# Altium project SPNEX_Payload.PrjPcb (part 2 of 3)

## Sheet LM_And_Busler_CAM.SchDoc
size A; SheetNumber: 5; SheetTotal: 6
Used 2 times, as channels LM Probe, High Resolution Camera. Parts and nets are listed once, with the designators drawn on the sheet.
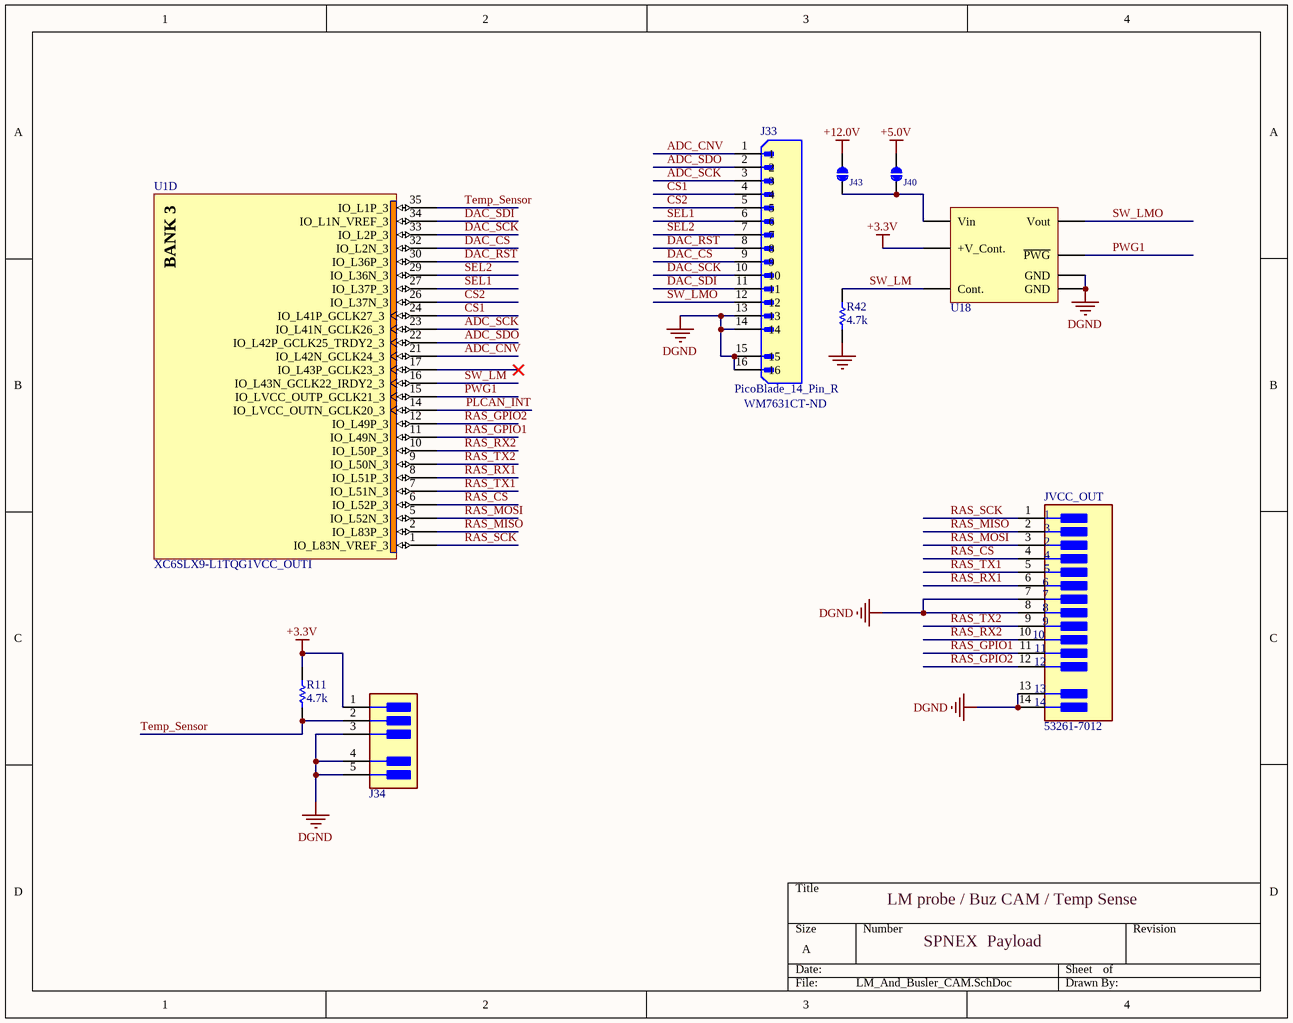
[diagram p3: LM_And_Busler_CAM.SchDoc]

### Parts
J33  PicoBlade_14_Pin_R  Supplier Part Number 1: WM7631CT-ND  [PicoBlade_14_pin_R]
J34  53261-0371  [FP-53261-0371-MFG]  (value not drawn)
J40  JUMPER  [SJMP]  (value not drawn)
J43  JUMPER  [SJMP]  (value not drawn)
JVCC_OUT  53261-7012  [MOLEX_12RA]
R11  Resistance (Ohms): 4.7k  [0603RES]  (hidden comment: RES_4.7K_0.1W_0603)
R42  Resistance (Ohms): 4.7k  [0603RES]  (hidden comment: RES_4.7K_0.1W_0603)
U1  XC6SLX9-L1TQG1VCC_OUTI  [TQG144_M]  (part D of 7)
U18  LTC3461 module  [OCPfootprint]  (value not drawn)

### Nets
+3.3V: J34.1 R11.2 U18.5(+V_Cont.)
+5.0V: J40.2
+12.0V: J43.2
DGND: J33.13 J33.14 J33.15 J33.16 J34.3 J34.4 J34.5 JVCC_OUT.7 JVCC_OUT.8 JVCC_OUT.13(MNT_1) JVCC_OUT.14(MNT_2) R42.2 U18.2(GND) U18.4(GND)
ADC_CNV: J33.1 U1.21(IO_L42N_GCLK24_3)
ADC_SCK: J33.3 U1.23(IO_L41N_GCLK26_3)
ADC_SDO: J33.2 U1.22(IO_L42P_GCLK25_TRDY2_3)
CS1: J33.4 U1.24(IO_L41P_GCLK27_3)
CS2: J33.5 U1.26(IO_L37N_3)
DAC_CS: J33.9 U1.32(IO_L2N_3)
DAC_RST: J33.8 U1.30(IO_L36P_3)
DAC_SCK: J33.10 U1.33(IO_L2P_3)
DAC_SDI: J33.11 U1.34(IO_L1N_VREF_3)
PLCAN_INT: U1.14(IO_LVCC_OUTN_GCLK20_3)
PWG1: U1.15(IO_LVCC_OUTP_GCLK21_3) U18.7(~{PWG})
RAS_CS: JVCC_OUT.4 U1.6(IO_L52P_3)
RAS_GPIO1: JVCC_OUT.11 U1.11(IO_L49N_3)
RAS_GPIO2: JVCC_OUT.12 U1.12(IO_L49P_3)
RAS_MISO: JVCC_OUT.2 U1.2(IO_L83P_3)
RAS_MOSI: JVCC_OUT.3 U1.5(IO_L52N_3)
RAS_RX1: JVCC_OUT.6 U1.8(IO_L51P_3)
RAS_RX2: JVCC_OUT.10 U1.10(IO_L50P_3)
RAS_SCK: JVCC_OUT.1 U1.1(IO_L83N_VREF_3)
RAS_TX1: JVCC_OUT.5 U1.7(IO_L51N_3)
RAS_TX2: JVCC_OUT.9 U1.9(IO_L50N_3)
SEL1: J33.6 U1.27(IO_L37P_3)
SEL2: J33.7 U1.29(IO_L36N_3)
SW_LM: R42.1 U1.16(IO_L43N_GCLK22_IRDY2_3) U18.6(Cont.)
SW_LMO: J33.12 U18.3(Vout)
Temp_Sensor: J34.2 R11.1 U1.35(IO_L1P_3)
NetJ40_1: J40.1 J43.1 U18.1(Vin)

Not connected (* = marked no-connect by the designer): U1 17(IO_L43P_GCLK23_3)*

### Channels
LM Probe: designators end in _LM_Probe
High Resolution Camera: designators end in _High_Resolution_Camera

### Notes on the sheet
- LM probe / Buz CAM / Temp Sense
- (in symbol XC6SLX9-L1TQG144I, part D) BANK 3

### Library data of the parts
J33 = PicoBlade_14_Pin_R: 1.25mm Pitch PicoBlade Header, Surface Mount, Right Angle, Lead-Free, 14 Circuits; Manufacturer: Molex; Manufacturer Part Number: 53261-1471; Supplier 1: Digi-Key; RoHS: Yes; Category: Headers and Wire Housings; ComponentLink1URL: https://datasheet.ciiva.com/5155/0532611471-pcb-headers-256969-5155455.pdf?src-supplier=Mouser; ComponentLink1Description: https://datasheet.ciiva.com/5155/0532611471-pcb-headers-256969-5155455.pdf?src-supplier=Mouser; ComponentLink2URL: https://datasheet.ciiva.com/30130/318250532611471-pcb-headers-30130464.pdf?src-supplier=Onlinecomponents.com; ComponentLink2Description: https://datasheet.ciiva.com/30130/318250532611471-pcb-headers-30130464.pdf?src-supplier=Onlinecomponents.com; ComponentLink3URL: https://datasheet.ciiva.com/11747/0900766b80d6dd0d-11747778.pdf?src-supplier=RSComponents; ComponentLink3Description: https://datasheet.ciiva.com/11747/0900766b80d6dd0d-11747778.pdf?src-supplier=RSComponents; ComponentLink4URL: https://datasheet.ciiva.com/7167/1626126-7167505.pdf?src-supplier=Newark; ComponentLink4Description: https://datasheet.ciiva.com/7167/1626126-7167505.pdf?src-supplier=Newark; ComponentLink5URL: https://datasheet.ciiva.com/14156/gh116861-116874-e-14156197.pdf?src-supplier=Distrelec; ComponentLink5Description: https://datasheet.ciiva.com/14156/gh116861-116874-e-14156197.pdf?src-supplier=Distrelec; ComponentLink6URL: https://datasheet.ciiva.com/7814/1767586-7814875.pdf?src-supplier=Element14; ComponentLink6Description: https://datasheet.ciiva.com/7814/1767586-7814875.pdf?src-supplier=Element14
J34 = 0532610371: Conn Shrouded Header HDR 3 POS 1.25mm Solder RA SMD PicoBlade™ Embossed T/R; Manufacturer: Molex; ComponentLink2Description: Datasheet; ComponentLink2URL: https://www.molex.com/webdocs/datasheets/pdf/en-us/0532610371_PCB_HEADERS.pdf; Supplier 1: Digi-Key; Manufacturer Part Number: 53261-0371; RoHS: Yes; Category: Headers and Wire Housings; Stock 1: 30734; Pricing 1: 1=0.72000, 10=0.61000, 100=0.47430 (USD); Supplier Part Number 1: WM7621CT-ND
J40 J43 = JUMPER: OPTION SELECTION PAD; Supplier 1: Digi-Key
JVCC_OUT = 53261-7012: 1.25mm Pitch, PicoBlade PCB Header, Single Row, Right-Angle, Surface Mount, Gold (Au) Plating, Friction Lock, 12...; Manufacturer: Molex; Supplier 1: Digi-Key; Manufacturer Part Number: 53261-7012; RoHS: No; Category: Headers and Wire Housings; Stock 1: 1355; Pricing 1: 1=2.68000, 10=2.28100, 100=1.88470 (USD); Supplier Part Number 1: 900-0532617012CT-ND
R11 R42 = RES_4.7K_0.1W_0603: Resistor; Manufacturer: Stackpole Electronics Inc.; Manufacturer Part Number: RMCF0603JT4K70; Tolerance: ±5%; Power (Watts): 0.1W, 1/10W; Temperature Coefficient: ±200ppm/°C; Supplier 1: Digi-Key; RoHS: RoHS Compliant; Category: Resistors; Stock 1: 86000; Pricing 1: 1=0.1, 10=0.012, 25=0.0088, 50=0.0066, 100=0.0049, 250=0.00372, 500=0.00298, 1000=0.0022 (USD); Packaging: Cut Tape (CT); Part Status: Active; Composition: Thick Film; Features: Automotive AEC-Q200; Operating Temperature: -55°C ~ 155°C; Package / Case: 0603 (1608 Metric); Supplier Device Package: 0603; Size / Dimension: 0.061" L x 0.031" W (1.55mm x 0.80mm); Height - Seated (Max): 0.022" (0.55mm); Number of Terminations: 2; Failure Rate: -; ComponentLink1URL: https://www.seielect.com/Catalog/SEI-RMCF_RMCP.pdf; ComponentLink1Description: https://www.seielect.com/Catalog/SEI-RMCF_RMCP.pdf; Supplier Part Number 1: RMCF0603JT4K70CT-ND
U1 = XC6SLX9-L1TQG144I: Spartan-6 LX 1.0V FPGA, 102 User I/Os, 144-Pin TQFP (0.5mm Pitch), Low Power Version, Industrial Grade, Pb-Free; Published: 17-Nov-2009; DatasheetVersion: ver1.6, Nov-2010; PackageVersion: ver1.2, Jun-2004; PackageReference: TQG144; Publisher: Altium Limited; PackageDescription: 144-Pin Thin Quad Flat Pack (TQG144) - Pb-Free; Code_JEDEC: MS-026-BFB; ComponentLink1Description: Manufacturer Link; ComponentLink1URL: http://www.xilinx.com; ComponentLink2Description: Spartan-6 Datasheet; ComponentLink2URL: http://www.xilinx.com/support/documentation/data_sheets/ds160.pdf; ComponentLink3Description: Spartan-6 Documents; ComponentLink3URL: http://www.xilinx.com/support/documentation/spartan-6.htm; ComponentLink4Description: Xilinx.com Home; ComponentLink4URL: http://www.xilinx.com; Supplier 1: Digi-Key; Supplier Part Number 1: 122-1779-ND
U18 = OCP_Module

## Sheet Storage Memory.SchDoc
size A; SheetNumber: 6; SheetTotal: 6
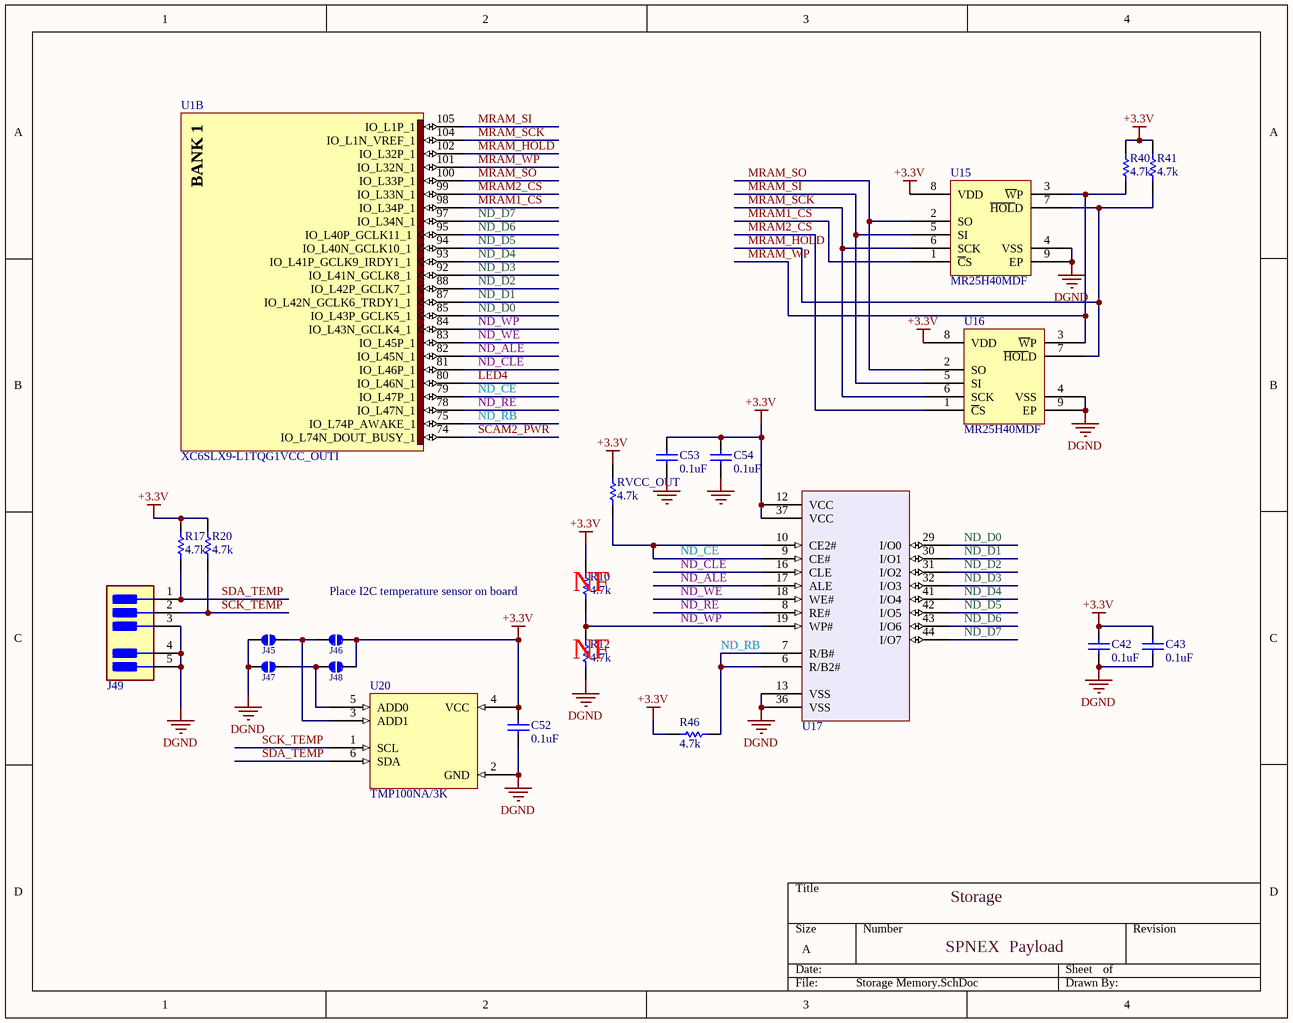
[diagram p4: Storage Memory.SchDoc]

### Parts
C42  0.1uF  [0805CAP]
C43  0.1uF  [0805CAP]
C52  0.1uF  [0805CAP]
C53  value 0.1uF  [0805 - CAP]  (hidden comment: Cap_CER_0.1U_16V_0805)
C54  value 0.1uF  [0805 - CAP]  (hidden comment: Cap_CER_0.1U_16V_0805)
J45  JUMPER  [SJMP]  (value not drawn)
J46  JUMPER  [SJMP]  (value not drawn)
J47  JUMPER  [SJMP]  (value not drawn)
J48  JUMPER  [SJMP]  (value not drawn)
J49  53261-0371  [FP-53261-0371-MFG]  (value not drawn)
R10  Resistance (Ohms): 4.7k  [0603RES]  (hidden comment: RES_4.7K_0.1W_0603)
R12  Resistance (Ohms): 4.7k  [0603RES]  (hidden comment: RES_4.7K_0.1W_0603)
R17  Resistance (Ohms): 4.7k  [0603RES]  (hidden comment: RES_4.7K_0.1W_0603)
R20  Resistance (Ohms): 4.7k  [0603RES]  (hidden comment: RES_4.7K_0.1W_0603)
R40  Resistance (Ohms): 4.7k  [0603RES]  (hidden comment: RES_4.7K_0.1W_0603)
R41  Resistance (Ohms): 4.7k  [0603RES]  (hidden comment: RES_4.7K_0.1W_0603)
R46  Resistance (Ohms): 4.7k  [0603RES]  (hidden comment: RES_4.7K_0.1W_0603)
RVCC_OUT  Resistance (Ohms): 4.7k  [0603RES]  (hidden comment: RES_4.7K_0.1W_0603)
U1  XC6SLX9-L1TQG1VCC_OUTI  [TQG144_M]  (part B of 7)
U15  MR25H40MDF  [DFN8]
U16  MR25H40MDF  [DFN8]
U17  MT29F8G08AB  [VOG48]  (value not drawn)
U20  TMP100NA/3K  [SOT-23-6]

### Nets
+3.3V: C42.2 C43.2 C52.2 C53.2 C54.2 J46.1 J48.1 R10.2 R17.2 R20.2 R40.1 R41.1 R46.1 RVCC_OUT.2 U15.8(VDD) U16.8(VDD) U17.12(VCC) U17.37(VCC) U20.4(VCC)
DGND: C42.1 C43.1 C52.1 C53.1 C54.1 J45.2 J47.2 J49.3 J49.4 J49.5 R12.1 U15.4(VSS) U15.9(EP) U16.4(VSS) U16.9(EP) U17.13(VSS) U17.36(VSS) U20.2(GND)
LED4: U1.80(IO_L46N_1)
MRAM1_CS: U1.98(IO_L34P_1) U15.1(~{C}S)
MRAM2_CS: U1.99(IO_L33N_1) U16.1(~{C}S)
MRAM_HOLD: R41.2 U1.102(IO_L32P_1) U15.7(~{HOL}D) U16.7(~{HOL}D)
MRAM_SCK: U1.104(IO_L1N_VREF_1) U15.6(SCK) U16.6(SCK)
MRAM_SI: U1.105(IO_L1P_1) U15.5(SI) U16.5(SI)
MRAM_SO: U1.100(IO_L33P_1) U15.2(SO) U16.2(SO)
MRAM_WP: R40.2 U1.101(IO_L32N_1) U15.3(~{W}P) U16.3(~{W}P)
ND_ALE: U1.82(IO_L45N_1) U17.17(ALE)
ND_CE: RVCC_OUT.1 U1.79(IO_L47P_1) U17.9(CE#) U17.10(CE2#)
ND_CLE: U1.81(IO_L46P_1) U17.16(CLE)
ND_D0: U1.85(IO_L43P_GCLK5_1) U17.29(I/O0)
ND_D1: U1.87(IO_L42N_GCLK6_TRDY1_1) U17.30(I/O1)
ND_D2: U1.88(IO_L42P_GCLK7_1) U17.31(I/O2)
ND_D3: U1.92(IO_L41N_GCLK8_1) U17.32(I/O3)
ND_D4: U1.93(IO_L41P_GCLK9_IRDY1_1) U17.41(I/O4)
ND_D5: U1.94(IO_L40N_GCLK10_1) U17.42(I/O5)
ND_D6: U1.95(IO_L40P_GCLK11_1) U17.43(I/O6)
ND_D7: U1.97(IO_L34N_1) U17.44(I/O7)
ND_RB: R46.2 U1.75(IO_L74P_AWAKE_1) U17.6(R/B2#) U17.7(R/B#)
ND_RE: U1.78(IO_L47N_1) U17.8(RE#)
ND_WE: U1.83(IO_L45P_1) U17.18(WE#)
ND_WP: R10.1 R12.2 U1.84(IO_L43N_GCLK4_1) U17.19(WP#)
SCAM2_PWR: U1.74(IO_L74N_DOUT_BUSY_1)
SCK_TEMP: J49.2 R20.1 U20.1(SCL)
SDA_TEMP: J49.1 R17.1 U20.6(SDA)
NetJ45_1: J45.1 J46.2 U20.3(ADD1)
NetJ47_1: J47.1 J48.2 U20.5(ADD0)

### Notes on the sheet
- Place I2C temperature sensor on board
- (near R10) NF
- (near R12) NF
- Storage
- (in symbol XC6SLX9-L1TQG144I, part B) BANK 1

### Library data of the parts
C42 C43 C52 = CAP_CER_0.1uf_10V_0805: Surface Mount Ceramic Multilayer Capacitor 0.1uF 10% X7R 16V 0805 Paper T/R; Manufacturer: Yageo; Manufacturer Part Number: CC0805KRX7R7BB104; Capacitance: 100nF; Insulation Resistance: 100GR; Supplier 1: Digi-Key; RoHS: Yes; Category: Ceramic Capacitors; Pricing 1: 1=0.12000, 10=0.08400, 50=0.04760, 100=0.03950, 500=0.02768, 1000=0.02291 (USD); Mount: Surface Mount; Case/Package: 0805; Number of Pins: 2; Case Code (Metric): 2012; Case Code (Imperial): 0805; Min Operating Temperature: -55°C; Max Operating Temperature: 125°C; Tolerance: 10%; Voltage Rating: 16V; Voltage Rating (DC): 16V; Packaging: Tape and Reel; Package Quantity: 1; Dielectric: X7R; Termination: SMD/SMT; Resistor Type: Ceramic; Voltage: 16V; Series: CC; Length: 2mm; Width: 0.049inch; Height: 0.85mm; Thickness: 0.033inch; Depth: 1.25mm; Radiation Hardening: No; REACH SVHC: No SVHC; Lead Free: Lead Free; Halogen Free: Halogen Free; RoHS Compliant: Yes; ComponentLink1URL: https://datasheet.ciiva.com/8034/1784427-8034017.pdf?src-supplier=Element14; ComponentLink1Description: https://datasheet.ciiva.com/8034/1784427-8034017.pdf?src-supplier=Element14; ComponentLink2URL: https://datasheet.ciiva.com/11786/0900766b80d84f1d-11786102.pdf?src-supplier=RSComponents; ComponentLink2Description: https://datasheet.ciiva.com/11786/0900766b80d84f1d-11786102.pdf?src-supplier=RSComponents; ComponentLink3URL: https://datasheet.ciiva.com/7978/1489800-7978204.pdf?src-supplier=Element14; ComponentLink3Description: https://datasheet.ciiva.com/7978/1489800-7978204.pdf?src-supplier=Element14; ComponentLink4URL: https://datasheet.ciiva.com/144/mlccorderingcode-144999.pdf?src-supplier=Digi-Key; ComponentLink4Description: https://datasheet.ciiva.com/144/mlccorderingcode-144999.pdf?src-supplier=Digi-Key; ComponentLink5URL: https://datasheet.ciiva.com/144/mlccorderingcode-144998.pdf?src-supplier=Digi-Key; ComponentLink5Description: https://datasheet.ciiva.com/144/mlccorderingcode-144998.pdf?src-supplier=Digi-Key; ComponentLink6URL: https://datasheet.ciiva.com/145/mlccorderingcode-145000.pdf?src-supplier=Digi-Key; ComponentLink6Description: https://datasheet.ciiva.com/145/mlccorderingcode-145000.pdf?src-supplier=Digi-Key; ComponentLink7URL: https://datasheet.ciiva.com/8034/1784427-8034015.pdf?src-supplier=Element14; ComponentLink7Description: https://datasheet.ciiva.com/8034/1784427-8034015.pdf?src-supplier=Element14; ComponentLink8URL: https://datasheet.ciiva.com/11465/upy-gphc-x7r-6-3v-to-50v-8-11465289.pdf?src-supplier=Avnet; ComponentLink8Description: https://datasheet.ciiva.com/11465/upy-gphc-x7r-6-3v-to-50v-8-11465289.pdf?src-supplier=Avnet; ComponentLink9URL: https://datasheet.ciiva.com/15189/getdatasheetpartid-314877-15189221.pdf?src-supplier=Verical; ComponentLink9Description: https://datasheet.ciiva.com/15189/getdatasheetpartid-314877-15189221.pdf?src-supplier=Verical; Supplier Part Number 1: 311-1142-1-ND
C53 C54 = Cap_CER_0.1U_16V_0805: CAP CER 0.1UF 16V X7R 0805; Manufacturer: Samsung Electro-Mechanics America, Inc.; Manufacturer Part Number: CL21B104KOANNNC; Tolerance: ±10%; Capacitance: 0.10µF; Supplier 1: Digi-Key; RoHS: RoHS Compliant; Category: Capacitors; Stock 1: 126841; Pricing 1: 1=0.1, 10=0.033, 25=0.024, 50=0.018, 100=0.0147, 250=0.01232, 500=0.0105, 1000=0.00825 (USD); Packaging: Digi-Reel®; Part Status: Active; Voltage - Rated: 16V; Temperature Coefficient: X7R; Operating Temperature: -55°C ~ 125°C; Features: -; Ratings: -; Applications: General Purpose; Mounting Type: Surface Mount, MLCC; Package / Case: 0805 (2012 Metric); Size / Dimension: 0.079" L x 0.049" W (2.00mm x 1.25mm); Height - Seated (Max): -; Thickness (Max): 0.030" (0.75mm); Lead Spacing: -; Lead Style: -; ComponentLink1URL: http://www.samsungsem.com/kr/support/product-search/mlcc/__icsFiles/afieldfile/2016/08/18/S_CL21B104KOANNNC.pdf; ComponentLink1Description: http://www.samsungsem.com/kr/support/product-search/mlcc/__icsFiles/afieldfile/2016/08/18/S_CL21B104KOANNNC.pdf; Supplier Part Number 1: 1276-2448-6-ND
J45-J48 = JUMPER: OPTION SELECTION PAD; Supplier 1: Digi-Key
J49 = 0532610371: as J34 on sheet LM_And_Busler_CAM; ComponentLink2Description: Datasheet; ComponentLink2URL: https://www.molex.com/webdocs/datasheets/pdf/en-us/0532610371_PCB_HEADERS.pdf; Supplier 1: Digi-Key; Manufacturer Part Number: 53261-0371; RoHS: Yes; Category: Headers and Wire Housings; Stock 1: 30734; Pricing 1: 1=0.72000, 10=0.61000, 100=0.47430 (USD); Supplier Part Number 1: WM7621CT-ND
R10 R12 R17 R20 R40 R41 R46 RVCC_OUT = RES_4.7K_0.1W_0603: as R11 on sheet LM_And_Busler_CAM; Supplier 1: Digi-Key; RoHS: RoHS Compliant; Category: Resistors; Stock 1: 86000; Pricing 1: 1=0.1, 10=0.012, 25=0.0088, 50=0.0066, 100=0.0049, 250=0.00372, 500=0.00298, 1000=0.0022 (USD); Packaging: Cut Tape (CT); Part Status: Active; Composition: Thick Film; Features: Automotive AEC-Q200; Operating Temperature: -55°C ~ 155°C; Package / Case: 0603 (1608 Metric); Supplier Device Package: 0603; Size / Dimension: 0.061" L x 0.031" W (1.55mm x 0.80mm); Height - Seated (Max): 0.022" (0.55mm); Number of Terminations: 2; Failure Rate: -; ComponentLink1URL: https://www.seielect.com/Catalog/SEI-RMCF_RMCP.pdf; ComponentLink1Description: https://www.seielect.com/Catalog/SEI-RMCF_RMCP.pdf; Supplier Part Number 1: RMCF0603JT4K70CT-ND
U1 = XC6SLX9-L1TQG144I: as U1 on sheet LM_And_Busler_CAM; Published: 17-Nov-2009; DatasheetVersion: ver1.6, Nov-2010; PackageVersion: ver1.2, Jun-2004; PackageReference: TQG144; Publisher: Altium Limited; PackageDescription: 144-Pin Thin Quad Flat Pack (TQG144) - Pb-Free; Code_JEDEC: MS-026-BFB; ComponentLink1Description: Manufacturer Link; ComponentLink1URL: http://www.xilinx.com; ComponentLink2Description: Spartan-6 Datasheet; ComponentLink2URL: http://www.xilinx.com/support/documentation/data_sheets/ds160.pdf; ComponentLink3Description: Spartan-6 Documents; ComponentLink3URL: http://www.xilinx.com/support/documentation/spartan-6.htm; ComponentLink4Description: Xilinx.com Home; ComponentLink4URL: http://www.xilinx.com; Supplier 1: Digi-Key; Supplier Part Number 1: 122-1779-ND
U15 U16 = MR25H40MDF: IC MRAM 4MBIT 40MHZ 8DFN; Manufacturer: Everspin Technologies Inc.; Memory Type: Non-Volatile; Memory Format: RAM; Memory Size: 4Mb (512K x 8); Memory Interface: SPI; Voltage - Supply: 3 V ~ 3.6 V; Supplier 1: Digi-Key; Manufacturer Part Number: MR25H40MDF; RoHS: RoHS Compliant; Category: Integrated Circuits (ICs); Stock 1: 1016; Pricing 1: 1=17.53, 10=16.232, 25=16.0068, 50=15.8102, 100=13.856, 250=13.257, 500=13.16862 (USD); Packaging: Tray; Part Status: Active; Technology: MRAM (Magnetoresistive RAM); Write Cycle Time - Word, Page: -; Operating Temperature: -40°C ~ 125°C (TA); Mounting Type: Surface Mount; Package / Case: 8-VDFN Exposed Pad; Supplier Device Package: 8-DFN-EP, Small Flag (5x6); ComponentLink1URL: https://www.everspin.com/file/156640/download; ComponentLink1Description: https://www.everspin.com/file/156640/download; Supplier Part Number 1: 819-1055-ND
U17 = MT29F32G08AFABAWP: 8Gb x8 NAND Flash Memory; CircuitryPartsPN: MICRON-MT29F8G08FACWP; ManufacturerPN: MT29F8G08FACWP; Manufacturer: Micron Technology Inc; CategoryI: Integrated Circuits (ICs); SchematicRev: A; DesignedBy: Circuitry Parts; MfgURL: http://www.micron.com/; PackageName: TSOPI48; FootprintName: *; CategoryII: NAND FLASH MEMORY; Value: *; DesignedOn: 7/18/2005 3:01:38 PM
U20 = Temp_Sensor_I2C: SENSOR TEMP I2C/SMBUS SOT23-6; Manufacturer: Texas Instruments; Interface: I2C,SMBus,2-Wire; Max Supply Voltage: 5.5V; Min Supply Voltage: 2.7V; Output Current: 4mA; Nominal Supply Current: 150uA; Resolution: 12b; Operating Supply Current: 75uA; Quiescent Current: 45uA; Number of Bits: 12; Output Type: I2C,Digital; Supplier 1: Digi-Key; RoHS: Yes; Category: Integrated Circuits (ICs); Stock 1: 2604; Pricing 1: 1=2.67000, 5=2.53000, 10=2.16900, 25=1.73520, 50=1.59040, 100=1.44590, 500=1.26516, 1000=1.12057 (USD); Mount: Surface Mount; Case/Package: SOT-23; Number of Pins: 6; Contact Plating: Gold; Min Operating Temperature: -55°C; Max Operating Temperature: 125°C; Package Quantity: 1; Packaging: Tape and Reel; Max Supply Voltage (DC): 5.5V; Min Supply Voltage (DC): 2.7V; Series: -; Supply Current: 150uA; Radiation Hardening: No; Lead Free: Lead Free; Reach SVHC Compliant: Yes; RoHS Compliant: Yes; ComponentLink1URL: https://datasheet.ciiva.com/15098/getdatasheetpartid-300076-15098434.pdf?src-supplier=Verical; ComponentLink1Description: https://datasheet.ciiva.com/15098/getdatasheetpartid-300076-15098434.pdf?src-supplier=Verical; ComponentLink2URL: https://datasheet.ciiva.com/41462/001014642-da-01-en-ic-temp-sensor-di-tmp100na-3k-sot-6-tid-41462493.pdf?src-supplier=Conrad; ComponentLink2Description: https://datasheet.ciiva.com/41462/001014642-da-01-en-ic-temp-sensor-di-tmp100na-3k-sot-6-tid-41462493.pdf?src-supplier=Conrad; ComponentLink3URL: https://datasheet.ciiva.com/5786/87915-5786666.pdf?src-supplier=Farnell; ComponentLink3Description: https://datasheet.ciiva.com/5786/87915-5786666.pdf?src-supplier=Farnell; ComponentLink4URL: https://datasheet.ciiva.com/1514/1772209-1514093.pdf?src-supplier=Element14; ComponentLink4Description: https://datasheet.ciiva.com/1514/1772209-1514093.pdf?src-supplier=Element14; ComponentLink5URL: https://datasheet.ciiva.com/46390/1882709-46390844.pdf?src-supplier=Element14; ComponentLink5Description: https://datasheet.ciiva.com/46390/1882709-46390844.pdf?src-supplier=Element14; ComponentLink6URL: https://datasheet.ciiva.com/2003/tmp100-2003004.pdf?src-supplier=Digi-Key; ComponentLink6Description: https://datasheet.ciiva.com/2003/tmp100-2003004.pdf?src-supplier=Digi-Key; ComponentLink7URL: https://datasheet.ciiva.com/2003/tmp100-2003003.pdf?src-supplier=Digi-Key; ComponentLink7Description: https://datasheet.ciiva.com/2003/tmp100-2003003.pdf?src-supplier=Digi-Key; ComponentLink8URL: https://datasheet.ciiva.com/2003/tmp100-2003005.pdf?src-supplier=Digi-Key; ComponentLink8Description: https://datasheet.ciiva.com/2003/tmp100-2003005.pdf?src-supplier=Digi-Key; ComponentLink9URL: https://datasheet.ciiva.com/3280/tmp101-3280141.pdf?src-supplier=Avnet; ComponentLink9Description: https://datasheet.ciiva.com/3280/tmp101-3280141.pdf?src-supplier=Avnet; Supplier Part Number 1: 296-26833-1-ND; Manufacturer Part Number: TMP100NA/3K

## Sheet BUS.SchDoc
size A4; SheetNumber: 3; SheetTotal: 6
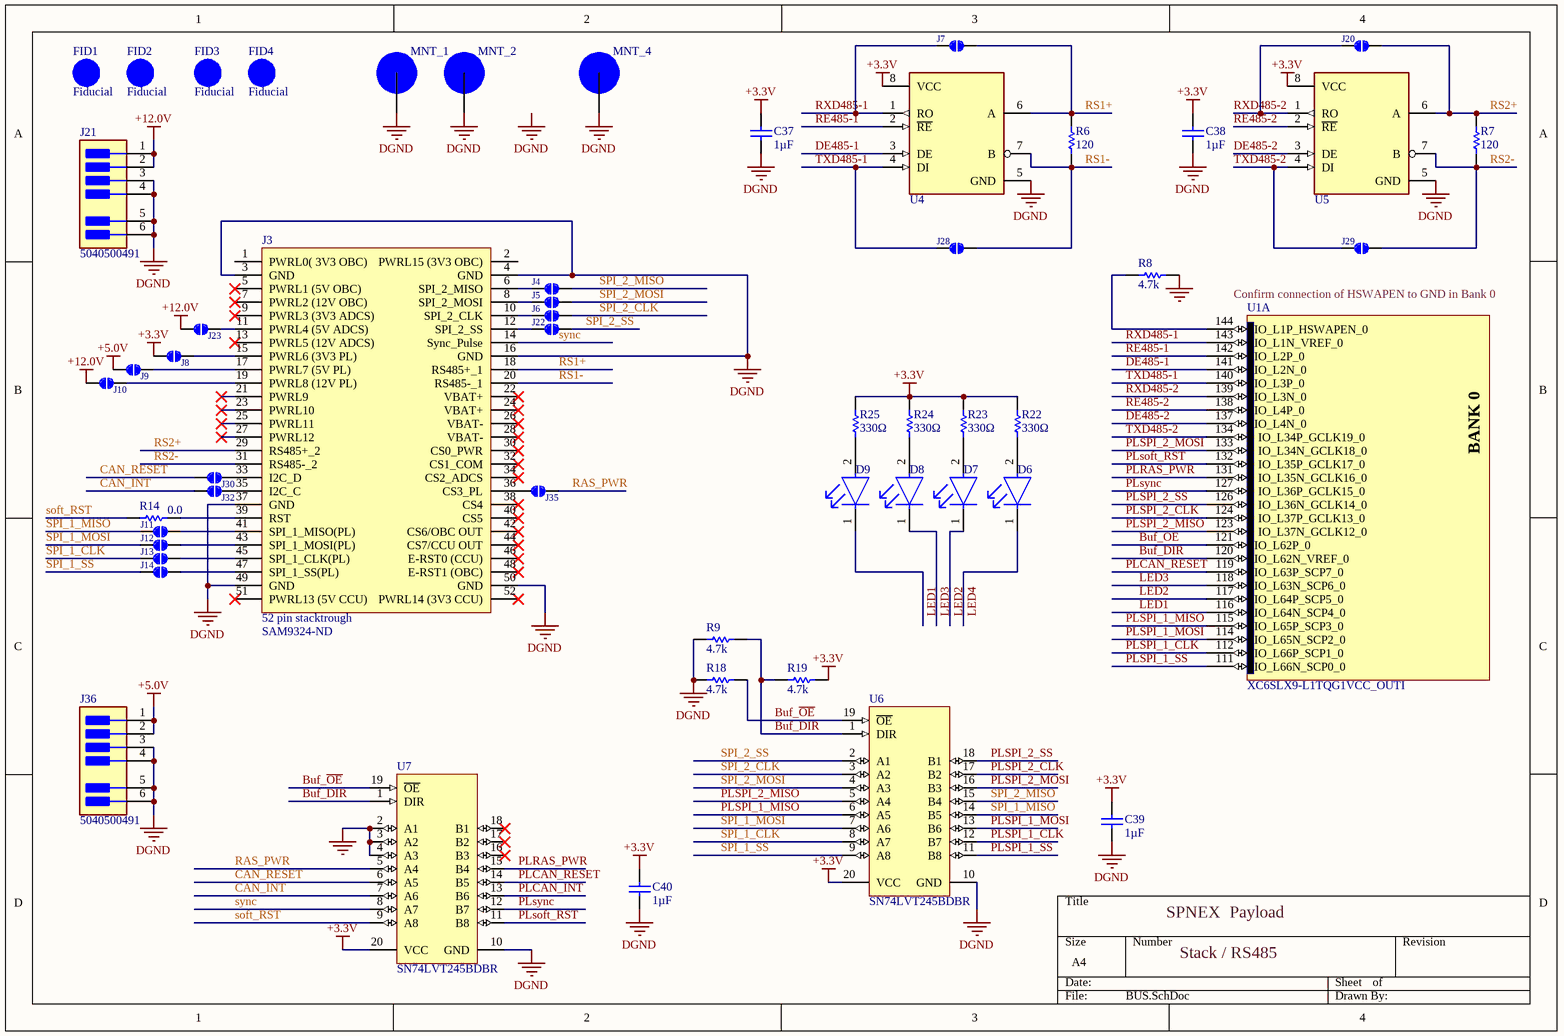
[diagram p5: BUS.SchDoc]

### Parts
C37  Capacitance: 1µF  [0603CAP]  (hidden comment: Cap_CER_1U_10V_0603)
C38  Capacitance: 1µF  [0603CAP]  (hidden comment: Cap_CER_1U_10V_0603)
C39  Capacitance: 1µF  [0603CAP]  (hidden comment: Cap_CER_1U_10V_0603)
C40  Capacitance: 1µF  [0603CAP]  (hidden comment: Cap_CER_1U_10V_0603)
D6  LED RED CLEAR 2SMD  [ROHM_SML-21_MFG]  (value not drawn)
D7  LED RED CLEAR 2SMD  [ROHM_SML-21_MFG]  (value not drawn)
D8  LED RED CLEAR 2SMD  [ROHM_SML-21_MFG]  (value not drawn)
D9  LED RED CLEAR 2SMD  [ROHM_SML-21_MFG]  (value not drawn)
FID1  Fiducial  [FID]  (no BOM)
FID2  Fiducial  [FID]  (no BOM)
FID3  Fiducial  [FID]  (no BOM)
FID4  Fiducial  [FID]  (no BOM)
J3  52 pin stacktrough  Supplier Part Number 1: SAM9324-ND  [StackThrough52]
J4  JUMPER  [SJMP]  (value not drawn)
J5  JUMPER  [SJMP]  (value not drawn)
J6  JUMPER  [SJMP]  (value not drawn)
J7  JUMPER  [SJMP]  (value not drawn)
J8  JUMPER  [SJMP]  (value not drawn)
J9  JUMPER  [SJMP]  (value not drawn)
J10  JUMPER  [SJMP]  (value not drawn)
J11  JUMPER  [SJMP]  (value not drawn)
J12  JUMPER  [SJMP]  (value not drawn)
J13  JUMPER  [SJMP]  (value not drawn)
J14  JUMPER  [SJMP]  (value not drawn)
J20  JUMPER  [SJMP]  (value not drawn)
J21  5040500491  [MOLEX_5040500491]
J22  JUMPER  [SJMP]  (value not drawn)
J23  JUMPER  [SJMP]  (value not drawn)
J28  JUMPER  [SJMP]  (value not drawn)
J29  JUMPER  [SJMP]  (value not drawn)
J30  JUMPER  [SJMP]  (value not drawn)
J32  JUMPER  [SJMP]  (value not drawn)
J35  JUMPER  [SJMP]  (value not drawn)
J36  5040500491  [MOLEX_5040500491]
MNT_1  Mount Hole  [Mount_Hole]  (value not drawn)  (no BOM)
MNT_2  Mount Hole  [Mount_Hole]  (value not drawn)  (no BOM)
MNT_4  Mount Hole  [Mount_Hole]  (value not drawn)  (no BOM)
R6  Resistance (Ohms): 120  [0603RES]  (hidden comment: RES_120_0.25W_0603)
R7  Resistance (Ohms): 120  [0603RES]  (hidden comment: RES_120_0.25W_0603)
R8  Resistance (Ohms): 4.7k  [0603RES]  (hidden comment: RES_4.7K_0.1W_0603)
R9  Resistance (Ohms): 4.7k  [0603RES]  (hidden comment: RES_4.7K_0.1W_0603)
R14  Resistance (Ohms): 0.0  [0603RES]  (hidden comment: RES_0_0.1W_0603)
R18  Resistance (Ohms): 4.7k  [0603RES]  (hidden comment: RES_4.7K_0.1W_0603)
R19  Resistance (Ohms): 4.7k  [0603RES]  (hidden comment: RES_4.7K_0.1W_0603)
R22  Resistance: 330Ω  [0603]  (hidden comment: RES_330 Ohm_0603)
R23  Resistance: 330Ω  [0603]  (hidden comment: RES_330 Ohm_0603)
R24  Resistance: 330Ω  [0603]  (hidden comment: RES_330 Ohm_0603)
R25  Resistance: 330Ω  [0603]  (hidden comment: RES_330 Ohm_0603)
U1  XC6SLX9-L1TQG1VCC_OUTI  [TQG144_M]  (part A of 7)
U4  ADM3493ARZ  [Soic8_IPCA]  (value not drawn)
U5  ADM3493ARZ  [Soic8_IPCA]  (value not drawn)
U6  SN74LVT245BDBR  [DB0020A_M]
U7  SN74LVT245BDBR  [DB0020A_M]

### Nets
+3.3V: C37.2 C38.2 C39.2 C40.2 J8.1 R19.1 R22.2 R23.2 R24.2 R25.2 U4.8(VCC) U5.8(VCC) U6.20(VCC) U7.20(VCC)
+5.0V: J9.1 J36.1 J36.2
+12.0V: J10.1 J21.1 J21.2 J23.1
DGND: C37.1 C38.1 C39.1 C40.1 J3.3(GND) J3.4(GND) J3.16(GND) J3.37(GND) J3.49(GND) J3.50(GND) J21.3 J21.4 J21.5 J21.6 J36.3 J36.4 J36.5 J36.6 MNT_1.1 MNT_2.1 MNT_4.1 R8.2 R9.2 R18.2 U4.5(GND) U5.5(GND) U6.10(GND) U7.2(A1) U7.3(A2) U7.4(A3) U7.10(GND)
Buf_DIR: R9.1 R19.2 U1.120(IO_L62N_VREF_0) U6.1(DIR) U7.1(DIR)
Buf_~{OE}: R18.1 U1.121(IO_L62P_0) U6.19(~{OE}) U7.19(~{OE})
CAN_INT: J32.1 U7.7(A6)
CAN_RESET: J30.1 U7.6(A5)
DE485-1: U1.141(IO_L2N_0) U4.3(DE)
DE485-2: U1.137(IO_L4N_0) U5.3(DE)
LED1: D9.1(C) U1.116(IO_L64N_SCP4_0)
LED2: D7.1(C) U1.117(IO_L64P_SCP5_0)
LED3: D8.1(C) U1.118(IO_L63N_SCP6_0)
LED4: D6.1(C)
PLCAN_INT: U7.13(B6)
PLCAN_RESET: U1.119(IO_L63P_SCP7_0) U7.14(B5)
PLRAS_PWR: U1.131(IO_L35N_GCLK16_0) U7.15(B4)
PLsoft_RST: U1.132(IO_L35P_GCLK17_0) U7.11(B8)
PLSPI_1_CLK: U1.112(IO_L66P_SCP1_0) U6.12(B7)
PLSPI_1_MISO: U1.115(IO_L65P_SCP3_0) U6.6(A5)
PLSPI_1_MOSI: U1.114(IO_L65N_SCP2_0) U6.13(B6)
PLSPI_1_SS: U1.111(IO_L66N_SCP0_0) U6.11(B8)
PLSPI_2_CLK: U1.124(IO_L37P_GCLK13_0) U6.17(B2)
PLSPI_2_MISO: U1.123(IO_L37N_GCLK12_0) U6.5(A4)
PLSPI_2_MOSI: U1.133(IO_L34N_GCLK18_0) U6.16(B3)
PLSPI_2_SS: U1.126(IO_L36N_GCLK14_0) U6.18(B1)
PLsync: U1.127(IO_L36P_GCLK15_0) U7.12(B7)
~{RE}485-1: U1.142(IO_L2P_0) U4.2(~{RE})
~{RE}485-2: U1.138(IO_L4P_0) U5.2(~{RE})
RAS_PWR: J35.2 U7.5(A4)
RS1+: J3.18(RS485+_1) J7.2 R6.2 U4.6(A)
RS1-: J3.20(RS485-_1) J28.2 R6.1 U4.7(B)
RS2+: J3.29(RS485+_2) J20.2 R7.2 U5.6(A)
RS2-: J3.31(RS485-_2) J29.2 R7.1 U5.7(B)
RXD485-1: J7.1 U1.143(IO_L1N_VREF_0) U4.1(RO)
RXD485-2: J20.1 U1.139(IO_L3N_0) U5.1(RO)
soft_RST: R14.1 U7.9(A8)
SPI_1_CLK: J13.1 U6.8(A7)
SPI_1_MISO: J11.1 U6.14(B5)
SPI_1_MOSI: J12.1 U6.7(A6)
SPI_1_SS: J14.1 U6.9(A8)
SPI_2_CLK: J6.2 U6.3(A2)
SPI_2_MISO: J4.2 U6.15(B4)
SPI_2_MOSI: J5.2 U6.4(A3)
SPI_2_SS: J22.2 U6.2(A1)
sync: J3.14(Sync_Pulse) U7.8(A7)
TXD485-1: J28.1 U1.140(IO_L3P_0) U4.4(DI)
TXD485-2: J29.1 U1.134(IO_L34P_GCLK19_0) U5.4(DI)
NetD6_2: D6.2(A) R22.1
NetD7_2: D7.2(A) R23.1
NetD8_2: D8.2(A) R24.1
NetD9_2: D9.2(A) R25.1
NetJ3_6: J3.6(SPI_2_MISO) J4.1
NetJ3_8: J3.8(SPI_2_MOSI) J5.1
NetJ3_10: J3.10(SPI_2_CLK) J6.1
NetJ3_11: J3.11(PWRL4_(5V_ADCS)) J23.2
NetJ3_12: J3.12(SPI_2_SS) J22.1
NetJ3_15: J3.15(PWRL6_(3V3_PL)) J8.2
NetJ3_17: J3.17(PWRL7_(5V_PL)) J9.2
NetJ3_19: J3.19(PWRL8_(12V_PL)) J10.2
NetJ3_33: J3.33(I2C_D) J30.2
NetJ3_35: J3.35(I2C_C) J32.2
NetJ3_36: J3.36(CS3_PL) J35.1
NetJ3_39: J3.39(RST) R14.2
NetJ3_41: J3.41(SPI_1_MISO(PL)) J11.2
NetJ3_43: J3.43(SPI_1_MOSI(PL)) J12.2
NetJ3_45: J3.45(SPI_1_CLK(PL)) J13.2
NetJ3_47: J3.47(SPI_1_SS(PL)) J14.2
NetR8_1: R8.1 U1.144(IO_L1P_HSWAPEN_0)

Not connected (* = marked no-connect by the designer): J3 1(PWRL0(_3V3_OBC)) 2(PWRL15_(3V3_OBC)) 5(PWRL1_(5V_OBC))* 7(PWRL2_(12V_OBC))* 9(PWRL3_(3V3_ADCS))* 13(PWRL5_(12V_ADCS))* 21(PWRL9)* 22(VBAT+)* 23(PWRL10)* 24(VBAT+)* 25(PWRL11)* 26(VBAT-)* 27(PWRL12)* 28(VBAT-)* 30(CS0_PWR)* 32(CS1_COM)* 34(CS2_ADCS)* 38(CS4)* 40(CS5)* 42(CS6/OBC_OUT)* 44(CS7/CCU_OUT)* 46(E-RST0_(CCU))* 48(E-RST1_(OBC))* 51(PWRL13_(5V_CCU))* 52(PWRL14_(3V3_CCU))*; U7 16(B3)* 17(B2)* 18(B1)*

### Notes on the sheet
- Confirm connection of HSWAPEN to GND in Bank 0
- Stack / RS485
- Labels drawn without touching a wire or pin: DGND
- (in symbol XC6SLX9-L1TQG144I, part A) BANK 0

### Library data of the parts
C37-C40 = Cap_CER_1U_10V_0603: Capacitor; Manufacturer: Taiyo Yuden; Manufacturer Part Number: LMK107B7105KA-T; Tolerance: ±10%; Voltage - Rated: 10V; Temperature Coefficient: X7R; Supplier 1: Digi-Key; RoHS: RoHS Compliant; Category: Capacitors; Stock 1: 600713; Pricing 1: 1=0.1, 10=0.042, 25=0.0308, 50=0.023, 100=0.0188, 250=0.01576, 500=0.01344, 1000=0.01056 (USD); Packaging: Cut Tape (CT); Part Status: Active; Operating Temperature: -55°C ~ 125°C; Features: -; Ratings: -; Applications: General Purpose; Mounting Type: Surface Mount, MLCC; Package / Case: 0603 (1608 Metric); Size / Dimension: 0.063" L x 0.031" W (1.60mm x 0.80mm); Height - Seated (Max): -; Thickness (Max): 0.035" (0.90mm); Lead Spacing: -; Lead Style: -; ComponentLink1URL: http://ds.yuden.co.jp/TYCOMPAS/ut/detail.do?productNo=LMK107B7105KA-T&fileName=LMK107B7105KA-T_SS&mode=specSheetDownload; ComponentLink1Description: http://ds.yuden.co.jp/TYCOMPAS/ut/detail.do?productNo=LMK107B7105KA-T&fileName=LMK107B7105KA-T_SS&mode=specSheetDownload; Supplier Part Number 1: 587-1242-1-ND
D6-D9 = APT2012LSECK/J3-PRV: Red 625nm LED Indication - Discrete 1.8V 0805 (2012 Metric); Manufacturer: Kingbright; Lens Color: Colorless; Luminous Intensity: 40mcd; Test Current: 2mA; Viewing Angle: 120°; Supplier 1: Digi-Key; Manufacturer Part Number: APT2012LSECK/J3-PRV; RoHS: Yes; Category: LEDs; Stock 1: 47256; Pricing 1: 1=0.68000, 10=0.41600, 100=0.23890, 1000=0.18698 (USD); Mount: Surface Mount; Case/Package: 0805; Color: Red; Case Code (Metric): 2012; Case Code (Imperial): 0805; Packaging: Tape and Reel; Lens Transparency: Clear; Dominant Wavelength: 625nm; Forward Voltage: 1.8V; Length: 2mm; Width: 1.25mm; Height: 0.75mm; RoHS Compliant: Yes; ComponentLink1URL: http://www.mouser.com/ds/2/216/APT2012LSECK-J3-PRV-535674.pdf?src-supplier=Mouser; ComponentLink1Description: http://www.mouser.com/ds/2/216/APT2012LSECK-J3-PRV-535674.pdf?src-supplier=Mouser; ComponentLink2URL: http://www.kingbrightusa.com/images/catalog/SPEC/APT2012LSECK-J3-PRV.pdf?src-supplier=Digi-Key; ComponentLink2Description: http://www.kingbrightusa.com/images/catalog/SPEC/APT2012LSECK-J3-PRV.pdf?src-supplier=Digi-Key; Supplier Part Number 1: 754-1935-1-ND
J3 = SPNEX_BUS: Conn Elevated Socket SKT 52 POS 2.54mm Solder ST Top Entry Thru-Hole Tube; Manufacturer: Samtec; Manufacturer Part Number: ESQ-126-38-G-D; Number of Contacts: 52; Gender: Female; Supplier 1: Digi-Key; RoHS: Yes; Category: Headers and Wire Housings; Stock 1: 81; Pricing 1: 1=17.62000, 16=15.26875, 80=12.58425, 440=11.49361 (USD); Mount: Through Hole; Contact Plating: Gold; Termination: Solder; Number of Rows: 2; Packaging: Bulk; Pitch: 2.54mm; Radiation Hardening: No; ComponentLink1URL: http://cloud.samtec.com/catalog_english/ESW_TH.PDF?src-supplier=Avnet; ComponentLink1Description: http://cloud.samtec.com/catalog_english/ESW_TH.PDF?src-supplier=Avnet; ComponentLink2URL: http://suddendocs.samtec.com/prints/esq-1xx-xx-x-x-xxx-xx-x-xx-mkt.pdf?src-supplier=Digi-Key; ComponentLink2Description: http://suddendocs.samtec.com/prints/esq-1xx-xx-x-x-xxx-xx-x-xx-mkt.pdf?src-supplier=Digi-Key
J4-J14 J20 J22 J23 J28-J30 J32 J35 = JUMPER: OPTION SELECTION PAD; Supplier 1: Digi-Key
J21 J36 = 5040500491: Connector Header Surface Mount, Right Angle 4 position 0.059" (1.50mm); Manufacturer: Molex; Supplier 1: Digi-Key; Manufacturer Part Number: 5040500491; RoHS: Yes; Category: Headers and Wire Housings; Stock 1: 197190; Pricing 1: 1=0.78000, 10=0.64700, 100=0.53880 (USD); ComponentLink1URL: https://datasheet.ciiva.com/48768/0532610471-pcb-headers-48768287.pdf?src-supplier=Avnet; ComponentLink1Description: https://datasheet.ciiva.com/48768/0532610471-pcb-headers-48768287.pdf?src-supplier=Avnet; Supplier Part Number 1: WM10137CT-ND
MNT_1 MNT_2 MNT_4 = MNT_Hole
R6 R7 = RES_120_0.25W_0603: RES SMD 120 OHM 5% 1/4W 0603; Manufacturer: Rohm Semiconductor; Manufacturer Part Number: ESR03EZPJ121; Power (Watts): 0.25W, 1/4W; Temperature Coefficient: ±200ppm/°C; Supplier 1: Digi-Key; RoHS: RoHS Compliant; Category: Resistors; Stock 1: 32826; Pricing 1: 1=0.1, 10=0.079, 25=0.0544, 50=0.0424, 100=0.0303, 250=0.0236, 500=0.01876, 1000=0.01331 (USD); Packaging: Digi-Reel®; Part Status: Active; Tolerance: ±5%; Composition: Thick Film; Features: Automotive AEC-Q200, Pulse Withstanding; Operating Temperature: -55°C ~ 155°C; Package / Case: 0603 (1608 Metric); Supplier Device Package: 0603; Size / Dimension: 0.063" L x 0.031" W (1.60mm x 0.80mm); Height - Seated (Max): 0.022" (0.55mm); Number of Terminations: 2; Failure Rate: -; ComponentLink1URL: http://rohmfs.rohm.com/en/products/databook/datasheet/passive/resistor/chip_resistor/esr.pdf; ComponentLink1Description: http://rohmfs.rohm.com/en/products/databook/datasheet/passive/resistor/chip_resistor/esr.pdf; Supplier Part Number 1: RHM120DDKR-ND
R8 R9 R18 R19 = RES_4.7K_0.1W_0603: as R11 on sheet LM_And_Busler_CAM; Supplier 1: Digi-Key; RoHS: RoHS Compliant; Category: Resistors; Stock 1: 86000; Pricing 1: 1=0.1, 10=0.012, 25=0.0088, 50=0.0066, 100=0.0049, 250=0.00372, 500=0.00298, 1000=0.0022 (USD); Packaging: Cut Tape (CT); Part Status: Active; Composition: Thick Film; Features: Automotive AEC-Q200; Operating Temperature: -55°C ~ 155°C; Package / Case: 0603 (1608 Metric); Supplier Device Package: 0603; Size / Dimension: 0.061" L x 0.031" W (1.55mm x 0.80mm); Height - Seated (Max): 0.022" (0.55mm); Number of Terminations: 2; Failure Rate: -; ComponentLink1URL: https://www.seielect.com/Catalog/SEI-RMCF_RMCP.pdf; ComponentLink1Description: https://www.seielect.com/Catalog/SEI-RMCF_RMCP.pdf; Supplier Part Number 1: RMCF0603JT4K70CT-ND
R14 = RES_0_0.1W_0603: Resistor; Manufacturer: Samsung Electro-Mechanics America, Inc.; Manufacturer Part Number: RC1608J000CS; Tolerance: Jumper; Power (Watts): 0.1W, 1/10W; Supplier 1: Digi-Key; RoHS: RoHS Compliant; Category: Resistors; Stock 1: 498586; Pricing 1: 1=0.1, 10=0.017, 25=0.0124, 50=0.0094, 100=0.0069, 250=0.00528, 500=0.00422, 1000=0.0031 (USD); Packaging: Cut Tape (CT); Part Status: Active; Composition: Thick Film; Features: Moisture Resistant; Temperature Coefficient: -; Operating Temperature: -55°C ~ 155°C; Package / Case: 0603 (1608 Metric); Supplier Device Package: 0603; Size / Dimension: 0.063" L x 0.031" W (1.60mm x 0.80mm); Height - Seated (Max): 0.022" (0.55mm); Number of Terminations: 2; Failure Rate: -; ComponentLink1URL: http://media.digikey.com/pdf/Data%20Sheets/Samsung%20PDFs/RC_Series_ds.pdf; ComponentLink1Description: http://media.digikey.com/pdf/Data%20Sheets/Samsung%20PDFs/RC_Series_ds.pdf; Supplier Part Number 1: 1276-3510-1-ND
R22-R25 = RES_330 Ohm_0603: Res Thick Film 0603 330 Ohm 5% 0.1W(1/10W) +/-200ppm/ßC Pad SMD Automotive T/R; Manufacturer: Panasonic; Manufacturer Part Number: ERJ-3GEYJ331V; Power Rating: 100mW; Voltage Rating: 75V; Temperature Coefficient: 200ppm/°C; Voltage Rating (DC): 50V; Supplier 1: Digi-Key; RoHS: Yes; Stock 1: 2750454; Pricing 1: 1 = 0.10000, 10 = 0.05400, 100 = 0.02190, 1000 = 0.00985, 2500 = 0.00855 (USD); Mount: Surface Mount; Case/Package: 0603; Weight: 7.1E-05oz; Case Code (Metric): 1608; Case Code (Imperial): 0603; Contact Plating: Tin; Min Operating Temperature: -55°C; Max Operating Temperature: 155°C; Tolerance: 5%; Packaging: Tape and Reel; Package Quantity: 1; Composition: Thick Film; Number of Terminations: 2; Termination: SMD/SMT; Military Standard: Not; Max Power Dissipation: 100mW; Features: Automotive AEC-Q200; Length: 1.6mm; Height: 0.45mm; Width: 0.031inch; Depth: 0.8mm; Radiation Hardening: No; REACH SVHC: No SVHC; Lead Free: Lead Free; ComponentLink1URL: https://datasheet.ciiva.com/34303/1988727-34303616.pdf?src-supplier=Jameco; ComponentLink1Description: https://datasheet.ciiva.com/34303/1988727-34303616.pdf?src-supplier=Jameco; ComponentLink2URL: https://datasheet.ciiva.com/11821/0900766b80f806dd-11821444.pdf?src-supplier=RSComponents; ComponentLink2Description: https://datasheet.ciiva.com/11821/0900766b80f806dd-11821444.pdf?src-supplier=RSComponents; ComponentLink3URL: https://datasheet.ciiva.com/9117/aoa0000ce1-9117173.pdf?src-supplier=Avnet; ComponentLink3Description: https://datasheet.ciiva.com/9117/aoa0000ce1-9117173.pdf?src-supplier=Avnet; ComponentLink4URL: https://datasheet.ciiva.com/16767/70255313-16767749.pdf?src-supplier=Allied+Electronics; ComponentLink4Description: https://datasheet.ciiva.com/16767/70255313-16767749.pdf?src-supplier=Allied+Electronics; ComponentLink5URL: https://datasheet.ciiva.com/15159/getdatasheetpartid-29203-15159270.pdf?src-supplier=Verical; ComponentLink5Description: https://datasheet.ciiva.com/15159/getdatasheetpartid-29203-15159270.pdf?src-supplier=Verical; ComponentLink6URL: https://datasheet.ciiva.com/28673/1678796-28673994.pdf?src-supplier=Element14; ComponentLink6Description: https://datasheet.ciiva.com/28673/1678796-28673994.pdf?src-supplier=Element14; ComponentLink7URL: https://datasheet.ciiva.com/6138/1500035-6138716.pdf?src-supplier=Farnell; ComponentLink7Description: https://datasheet.ciiva.com/6138/1500035-6138716.pdf?src-supplier=Farnell; ComponentLink8URL: https://datasheet.ciiva.com/46381/1500035-46381164.pdf?src-supplier=Element14; ComponentLink8Description: https://datasheet.ciiva.com/46381/1500035-46381164.pdf?src-supplier=Element14; ComponentLink9URL: https://datasheet.ciiva.com/16449/aoa0000ce1-16449005.pdf?src-supplier=Future+Electronics; ComponentLink9Description: https://datasheet.ciiva.com/16449/aoa0000ce1-16449005.pdf?src-supplier=Future+Electronics; Supplier Part Number 1: P330GCT-ND
U1 = XC6SLX9-L1TQG144I: as U1 on sheet LM_And_Busler_CAM; Published: 17-Nov-2009; DatasheetVersion: ver1.6, Nov-2010; PackageVersion: ver1.2, Jun-2004; PackageReference: TQG144; Publisher: Altium Limited; PackageDescription: 144-Pin Thin Quad Flat Pack (TQG144) - Pb-Free; Code_JEDEC: MS-026-BFB; ComponentLink1Description: Manufacturer Link; ComponentLink1URL: http://www.xilinx.com; ComponentLink2Description: Spartan-6 Datasheet; ComponentLink2URL: http://www.xilinx.com/support/documentation/data_sheets/ds160.pdf; ComponentLink3Description: Spartan-6 Documents; ComponentLink3URL: http://www.xilinx.com/support/documentation/spartan-6.htm; ComponentLink4Description: Xilinx.com Home; ComponentLink4URL: http://www.xilinx.com; Supplier 1: Digi-Key; Supplier Part Number 1: 122-1779-ND
U4 U5 = ADM3493ARZ: Manufacturer: Analog Devices; Simplex/Duplex: Half Duplex; Receiver Hysteresis: 50mV; Logic Function: Transceiver; Number of Drivers: 1; Operating Supply Current: 2.2mA; ESD Protection: No; Data Rate: 250Kbps; Operating Supply Voltage: 3.3V; Min Supply Voltage: 3V; Max Supply Voltage: 3.6V; Interface: RS-422,RS-485; Supplier 1: Digi-Key; Manufacturer Part Number: ADM3493ARZ; RoHS: Yes; Stock 1: 35; Pricing 1: 1 = 2.92000, 10 = 2.62400, 25 = 2.47520, 100 = 1.98000, 250 = 1.73252, 500 = 1.68300, 1000 = 1.33650, 2500 = 1.31670 (USD); Mount: Surface Mount; Case/Package: SOIC; Number of Pins: 8; Contact Plating: Tin,Matte; Weight: 0.019048oz; Min Operating Temperature: -40°C; Max Operating Temperature: 85°C; Package Quantity: 98; Number of Transceivers: 1; Max Supply Current: 2.2mA; Packaging: Rail/Tube; Number of Receivers: 1; Number of Transmitters: 1; Nominal Supply Current: 2.2mA; Length: 5mm; Width: 4mm; Height: 1.5mm; Radiation Hardening: No; Lead Free: Contains Lead; REACH SVHC: No SVHC; ComponentLink1URL: https://datasheet.ciiva.com/3028/adm3493-3028992.pdf?src-supplier=Avnet; ComponentLink1Description: https://datasheet.ciiva.com/3028/adm3493-3028992.pdf?src-supplier=Avnet; ComponentLink2URL: https://datasheet.ciiva.com/1147/197012-1147564.pdf?src-supplier=Element14; ComponentLink2Description: https://datasheet.ciiva.com/1147/197012-1147564.pdf?src-supplier=Element14; ComponentLink3URL: https://datasheet.ciiva.com/1700/adm3493-1700154.pdf?src-supplier=Digi-Key; ComponentLink3Description: https://datasheet.ciiva.com/1700/adm3493-1700154.pdf?src-supplier=Digi-Key; ComponentLink4URL: https://datasheet.ciiva.com/15151/getdatasheetpartid-202037-15151690.pdf?src-supplier=Verical; ComponentLink4Description: https://datasheet.ciiva.com/15151/getdatasheetpartid-202037-15151690.pdf?src-supplier=Verical; ComponentLink5URL: https://datasheet.ciiva.com/48706/001248446-da-01-en-ic-txrx-rs-422-485-adm3493arz-soic-8-adi-48706090.pdf?src-supplier=Conrad; ComponentLink5Description: https://datasheet.ciiva.com/48706/001248446-da-01-en-ic-txrx-rs-422-485-adm3493arz-soic-8-adi-48706090.pdf?src-supplier=Conrad; Supplier Part Number 1: ADM3493ARZ-ND
U6 U7 = SN74LVT245BDBR: 3.3-V ABT Octal Bus Transceivers With 3-State Outputs, DB0020A, LARGE T&R; Manufacturer: Texas Instruments; Technology Family: LVT; VCC(Min)(V): 2.7; Input Type: TTL/CMOS; Output Type: LVTTL; F @ Nom Voltage(Max)(Mhz): 160; VCC(Max)(V): 3.6; ICC @ Nom Voltage(Max)(mA): 5; Output Drive (IOL/IOH)(Max)(mA): -32/64; Schmitt Trigger: No; Rating: Catalog; tpd @ Nom Voltage(Max)(ns): 3.5; Bits(#): 8; Voltage(Nom)(V): 3.3; Operating Temperature Range(C): -40 to 85; PartNumber: SN74LVT245BDBR; ComponentLink1Description: Manufacturer URL; ComponentLink2Description: Datasheet; DatasheetVersion: SCES004H; ComponentLink3URL: http://www.ti.com/lit/ml/mpds508/mpds508.pdf; ComponentLink1URL: http://www.ti.com/; Code_JEDEC: MO-150; ComponentLink2URL: http://www.ti.com/lit/ds/symlink/sn74lvt245b.pdf; PackageReference: DB0020A; ComponentLink3Description: Package Specification; Generic Part Number: SN74LVT245B; Supplier 1: Digi-Key; Supplier Part Number 1: 296-8650-1-ND